# Altium schematic sheet DSO_Front.SchDoc: Schematic_Name
size A4; CompanyName: University of Melbourne; Engineer: Your Name Here; DocumentNumber: 1; Revision: 0.1; SheetNumber: 1; SheetTotal: 1; Title_Project: Project_Title; StudentNo: Student No.
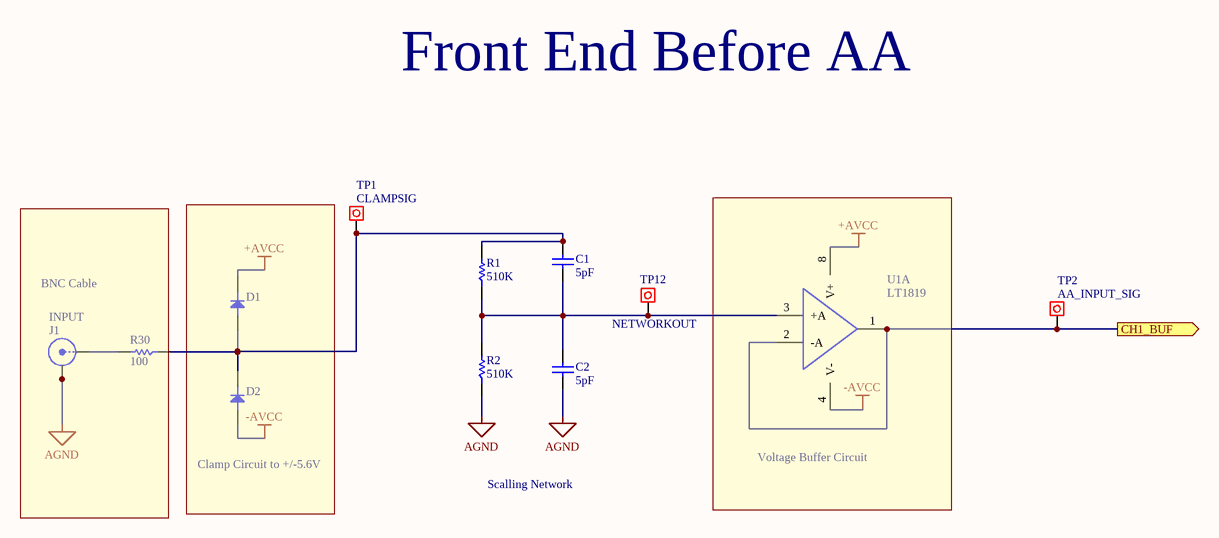
[diagram p0: DSO_Front.SchDoc]

## Parts
C1  5pF  [0805C]
C2  5pF  [0805C]
D1  Diode  [SOD-123]  (value not drawn)
D2  Diode  [SOD-123]  (value not drawn)
J1  INPUT  [BNC_VERT]
R1  510K  [0805]
R2  510K  [0805]
R30  100  [0805]
TP1  value CLAMPSIG  [Testpoin]  (hidden comment: INPUT)
TP2  value AA_INPUT_SIG  [Testpoin]  (hidden comment: INPUT)
TP12  value NETWORKOUT  [Testpoin]  (hidden comment: INPUT)
U1  LT1819  [SOIC-8]  (part A of 2)

## Blocks framed on the sheet
BNC Cable: J1 R30
Clamp Circuit to +/-5.6V: D1 D2
Voltage Buffer Circuit: U1

## Ports
CH1_BUF (out)

## Nets
+AVCC: D1.K U1.8(V+)
-AVCC: D2.A U1.4(V-)
AGND: C2.2 J1.2(Y) J1.3(Y) J1.4(Y) J1.5(Y) R2.1
CH1_BUF: TP2.1 U1.1(OUTA) U1.2(-A) ; port CH1_BUF
NetC1_1: C1.1 D1.A D2.K R1.2 R30.1 TP1.1
NetC1_2: C1.2 C2.1 R1.1 R2.2 TP12.1 U1.3(+A)
NetJ1_1: J1.1(X) R30.2

## Notes on the sheet
- Front End Before AA
- Scalling Network

## Library data of the parts
C1 C2 = C: Capacitor; Reviewed by: RM - 2018/08/05; Revision: July-2002: Re-released for DXP Platform.; Supplier 1: *; Supplier Part Number 1: *; Value: 5pF
D1 D2 = D: Reviewed by: RM - 2018/08/05; Revision: July-2002: Re-released for DXP Platform.; Supplier 1: *; Supplier Part Number 1: *
J1 = BNC: BNC Straight; Reviewed by: RM - 2018/08/05; Supplier Part Number 1: A97581-ND; Supplier 1: Digi-Key
R1 R2 R30 = R: Resistor; Reviewed by: RM - 2018/08/05; Supplier 1: *; Suppler Part Number 1: *
  R1 R2: Value: 510K
  R30: Value: 100
TP1 TP2 TP12 = Test Point: Pad
U1 = LT1819: OpAmp High Frequency Dual; Reviewed by: RM - 2018/08/05; Supplier 1: Digi-Key; Supplier Part Number 1: LT1819CMS8#PBF-ND